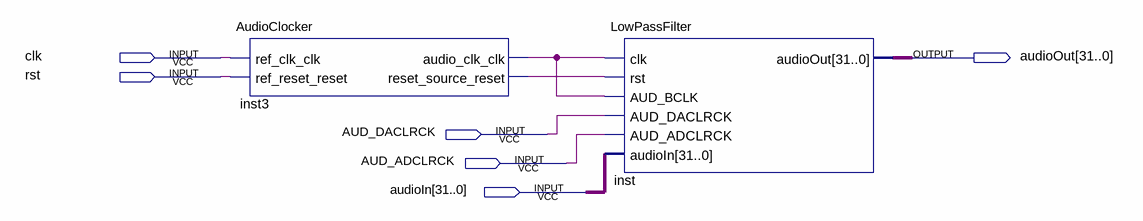
[diagram p0: schematic sheet]
// Quartus schematic filter_.bdf as structural Verilog: 2 symbols, 6 pins
module filter_ (
  input  clk,
  input  rst,
  input  AUD_DACLRCK,
  input  AUD_ADCLRCK,
  input  [31:0] audioIn,
  output [31:0] audioOut
);

  wire inst3_audio_clk_clk, inst3_reset_source_reset;

  AudioClocker inst3 (
    .ref_clk_clk(clk), .ref_reset_reset(rst), .audio_clk_clk(inst3_audio_clk_clk),
    .reset_source_reset(inst3_reset_source_reset));
  LowPassFilter inst (
    .clk(inst3_audio_clk_clk), .rst(inst3_reset_source_reset), .AUD_BCLK(inst3_audio_clk_clk),
    .AUD_DACLRCK(AUD_DACLRCK), .AUD_ADCLRCK(AUD_ADCLRCK), .audioIn(audioIn), .audioOut(audioOut));
endmodule
